# EAGLE design Genesis_Model2_RGB_LED (EAGLE 7.5.0)
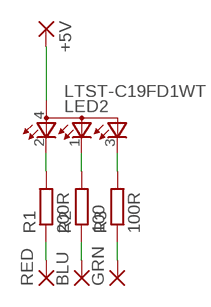
[diagram p0: schematic, sheet 1]

## Parts
+5V  SMD2TOP  [SMD_SOIC]
BLU  SMD2TOP  [SMD_SOIC]
GRN  SMD2TOP  [SMD_SOIC]
LED2  LTST-C19FD1WT  [LTST-C19FD1WT]
R1  200R  R-EU_R0805  [R0805]
R2  100  R-EU_R0805  [R0805]
R3  100R  R-EU_R0805  [R0805]
RED  SMD2TOP  [SMD_SOIC]

## Nets
N$1: +5V.1(P) LED2.4(A)
N$2: LED2.2(CRED) R1.2
N$3: LED2.1(CBLUE) R2.2
N$4: LED2.3(CGREEN) R3.2
N$7: R1.1 RED.1(P)
N$8: BLU.1(P) R2.1
N$9: GRN.1(P) R3.1

## Library data of the parts
+5V BLU GRN RED = TRP_Custom:SMD2: SMD PAD
LED2 = TRP_Custom:LTST-C19FD1WT: Chip LED RGB Source: http://optoelectronics.liteon.com/upload/download/DS22-2001-076/S_110_LTST-C19FD1WT.pdf
R1-R3 = resistor:R-EU_: RESISTOR, European symbol

## Board
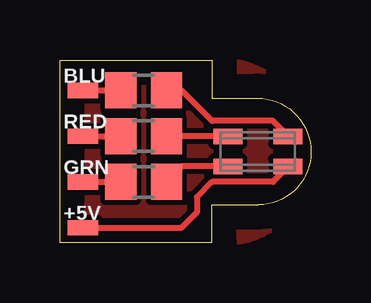
[diagram p1: board, top side]
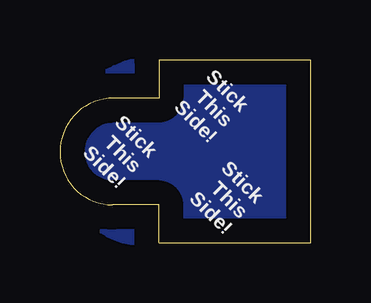
[diagram p2: board, bottom side, seen from below]

Size 10.48 x 7.62 mm. Coordinates in mm from the lower left corner, seen from the top.
Outline: 6.35,0 0,0 0,7.62 6.35,7.62 6.35,6.03 8.23,6.03 arc-90 10.48,3.79 arc-90 8.28,1.59 6.35,1.59 6.35,0
Copper layers (1*16): Top 0.035mm / dielectric 1.5mm / Bottom 0.035mm
Design rules "default": minimum track width 10mil, minimum drill 24mil, track to track 8mil, track to pad 8mil, pad to pad 8mil, via to via 8mil, smd to smd 8mil, copper to edge 40mil, drill to drill 8mil, minimum pad ring 10mil, minimum via ring 8mil, stop-mask expansion 4mil, vias tented up to drill 0mil, thermal gap 10mil

### Footprints (pad centres in the part's own frame; a part is rotated, then mirrored left to right if it is on the bottom)
SMD_SOIC = smd 0.635 x 1.27: 1 0,0
LTST-C19FD1WT = smd 0.65 x 1.2: 1 -0.625,1.25; 2 -0.625,-1.25; 3 0.625,-1.25; 4 0.625,1.25
R0805 = smd 1.3 x 1.5: 1 -0.95,0; 2 0.95,0

### Placement (x,y rotation side)
+5V  0.95,0.64 90 top
BLU  0.95,6.35 90 top
GRN  0.95,2.54 90 top
LED2  8.26,3.81 270 top
R1  3.49,4.45 0 top
R2  3.49,6.35 0 top
R3  3.49,2.54 0 top
RED  0.95,4.45 270 top

### Tracks (layer width: path | path; a pad name or v marks a point on that pad's centre or on a via)
GND
  pour Top: 0,7.62 6.46,7.62 arc-90 10.48,3.92 arc-90 7.19,0 0,0
  pour Bottom: 0,7.62 6.46,7.62 arc-90 10.48,3.92 arc-90 7.19,0 0,0
N$1
  Top 0.254: LED2.4 9.54,3.19 8.89,2.54 6.35,2.54 5.71,1.91 5.71,1.27 5.08,0.64 +5V.1
N$2
  Top 0.254: LED2.2 4.45,4.43 R1.2
N$3
  Top 0.254: LED2.1 9.54,4.43 8.89,5.08 6.35,5.08 5.08,6.35 R2.2
N$4
  Top 0.254: LED2.3 5.09,3.19 R3.2
N$7
  Top 0.254: RED.1 R1.1
N$8
  Top 0.254: BLU.1 R2.1
N$9
  Top 0.254: GRN.1 R3.1

### Text on the board
bNames: Stick / This / Side! | Stick / This / Side! | Stick / This / Side!